# Altium schematic sheet EEPROM.SchDoc: Onboard Pressure/Temperature Sensor
size Tabloid; Author: Set in Document Options » Parameters » Author + Contact info
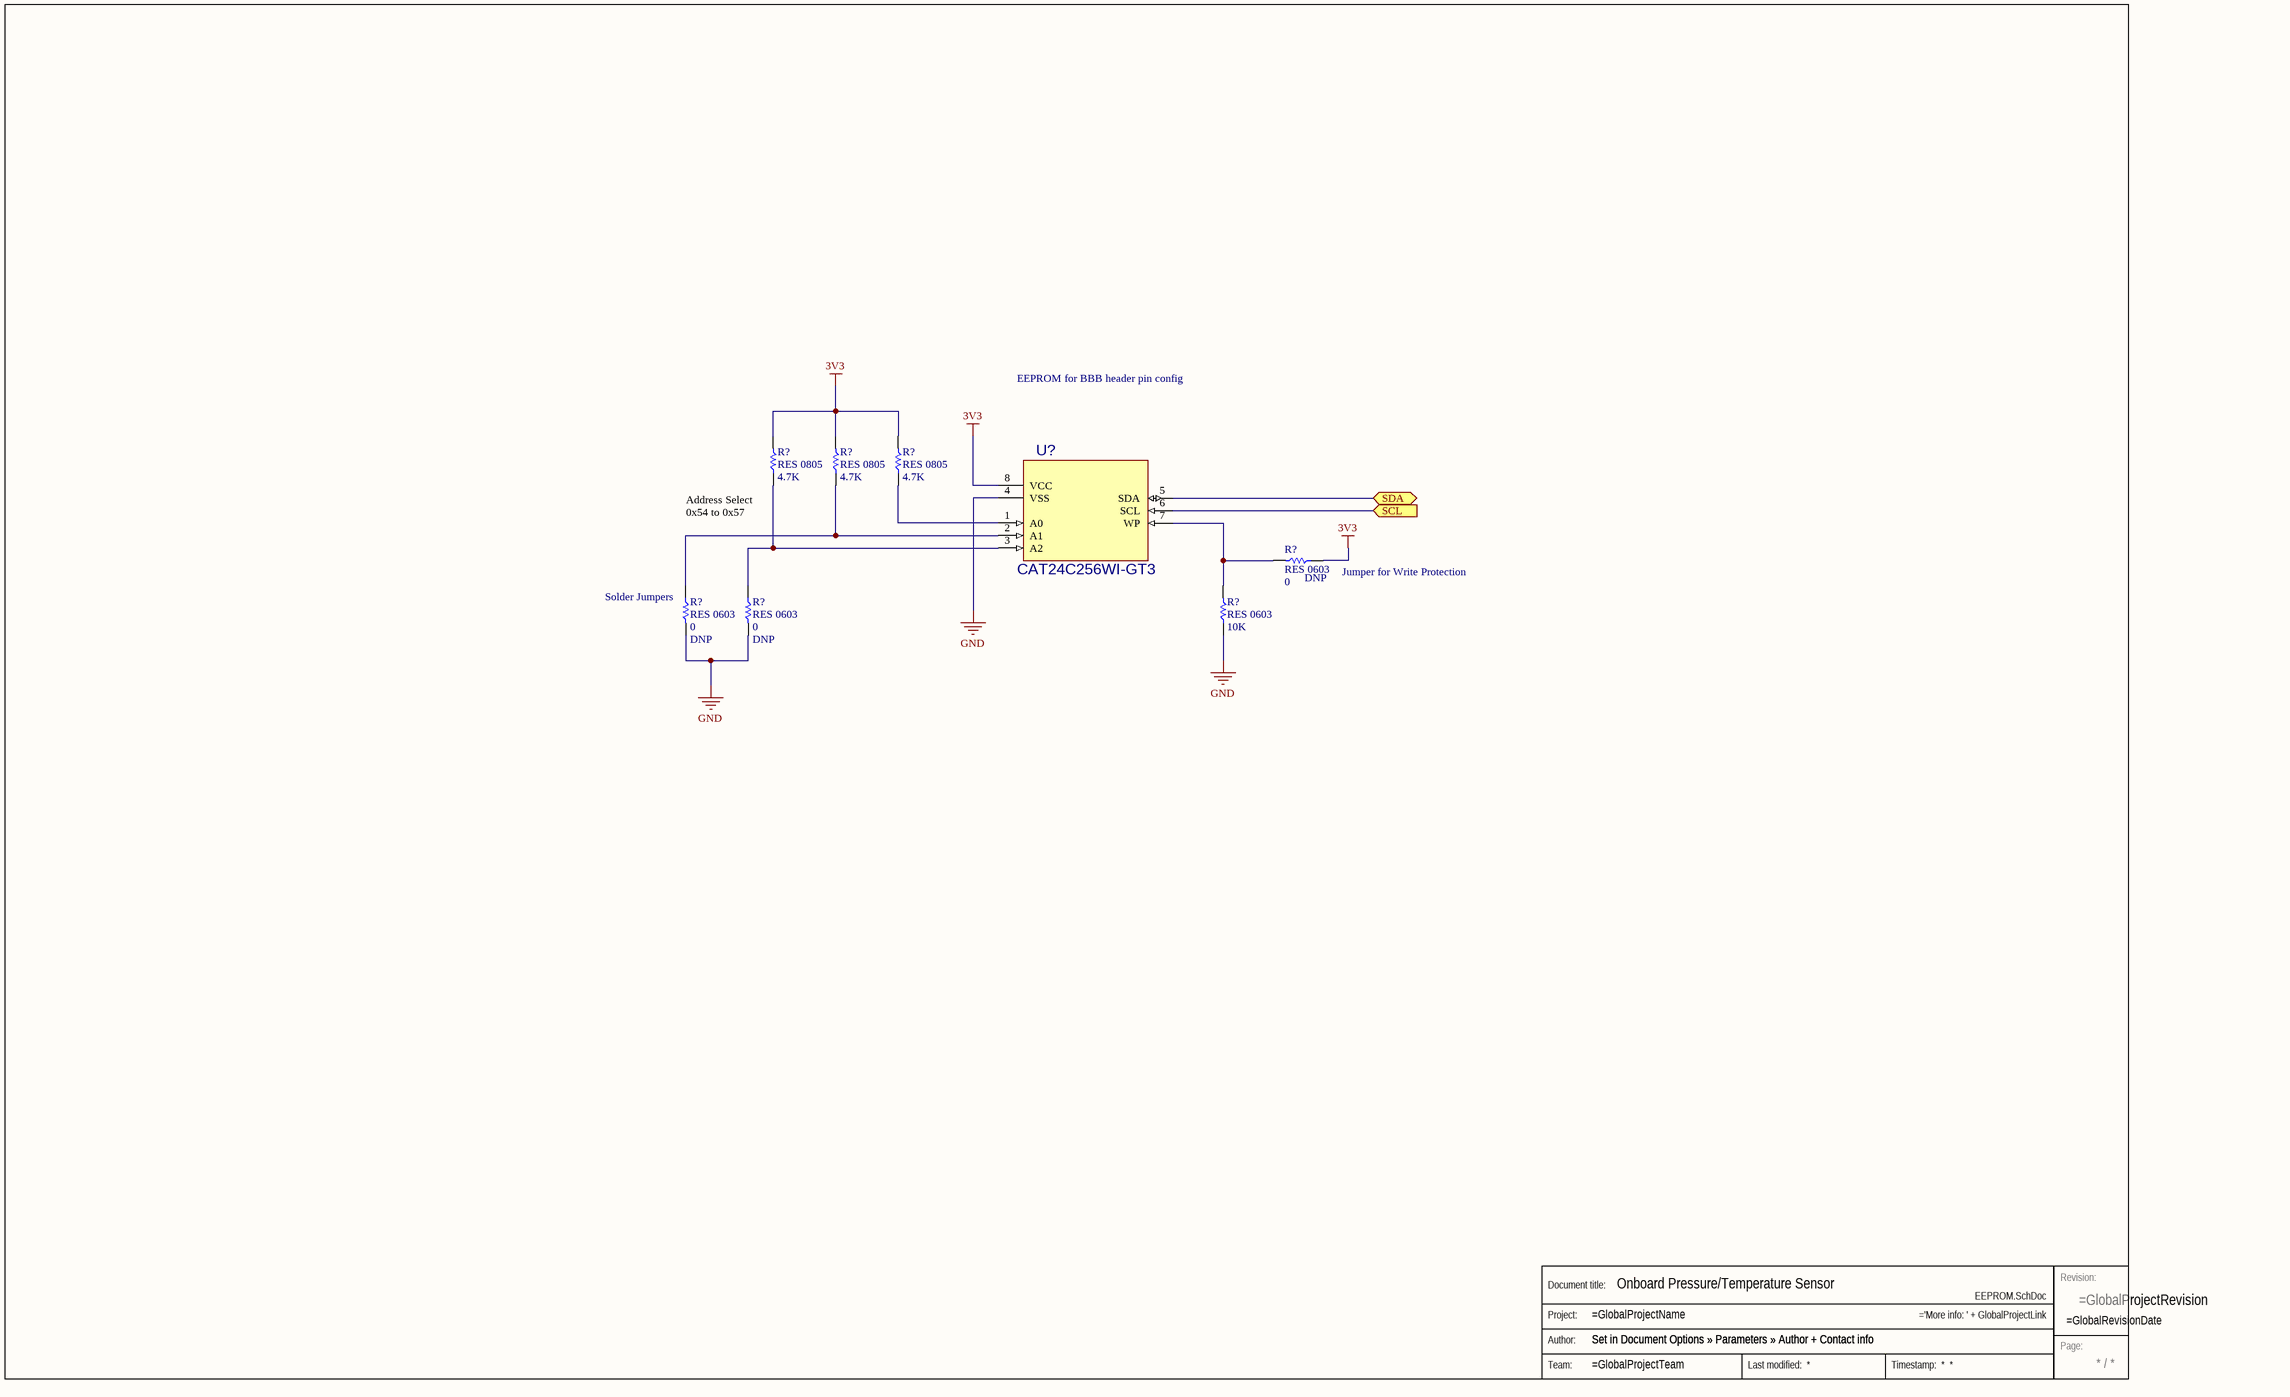
[diagram p0: EEPROM.SchDoc]

## Parts
(Parts that share a designator on the sheet are numbered #1, #2 ... from top to bottom, then left to right.)
R?#1  RES 0805  Value (Ohms): 4.7K  [RES 0805]
R?#2  RES 0805  Value (Ohms): 4.7K  [RES 0805]
R?#3  RES 0805  Value (Ohms): 4.7K  [RES 0805]
R?#4  RES 0603  Value (Ohms): 0  Do Not Place: DNP  [RES 0603]
R?#5  RES 0603  Value (Ohms): 10K  [RES 0603]
R?#6  RES 0603  Value (Ohms): 0  Do Not Place: DNP  [RES 0603]
R?#7  RES 0603  Value (Ohms): 0  Do Not Place: DNP  [RES 0603]
Stamp  Stamp  (value not drawn)  (graphical)
U?  CAT24C256WI-GT3  [SOIC127P600X175-8N]

## Ports
SCL (in), SDA (bidir)

## Nets
3V3: R?#1.1 R?#2.1 R?#3.1 R?#4.2 U?.8(VCC)
GND: R?#5.2 R?#6.1 R?#7.1 U?.4(VSS)
SCL: U?.6(SCL) ; port SCL
SDA: U?.5(SDA) ; port SDA
NetR?#1_2: R?#1.2 R?#7.2 U?.3(A2)
NetR?#2_2: R?#2.2 R?#6.2 U?.2(A1)
NetR?#3_2: R?#3.2 U?.1(A0)
NetR?#4_1: R?#4.1 R?#5.1 U?.7(WP)

## Notes on the sheet
- EEPROM for BBB header pin config
- (near R?#1) Address Select
  0x54 to 0x57
- (near R?#4) Jumper for Write Protection
- (near R?#6) Solder Jumpers
- (in symbol Stamp) Revision:; Document title:; Project:; Author:; Page:; Team:

## Library data of the parts
U? = CAT24C256WI-GT3: CAT24C256 Series 256 kbit %2832 K x 8%29 1.8 V I2C CMOS Serial EEPROM - SOIC-8; MF: ON Semiconductor; MP: CAT24C256WI-GT3; Price: 0.32 USD; Package: SOIC-8 ON Semiconductor; Availability: Good; Value: *; Mouser: http://www.mouser.com/ProductDetail/ON-Semiconductor/CAT24C256WI-GT3/?qs=sGAEpiMZZMuVhdAcoizlReWCLrywymY2%2fLYsR6sjnIQ%3d
R?#1-R?#3 = RES 0805: PartNumber: *; Tolerance: *
R?#4-R?#7 = RES 0603: PartNumber: *; Tolerance: *